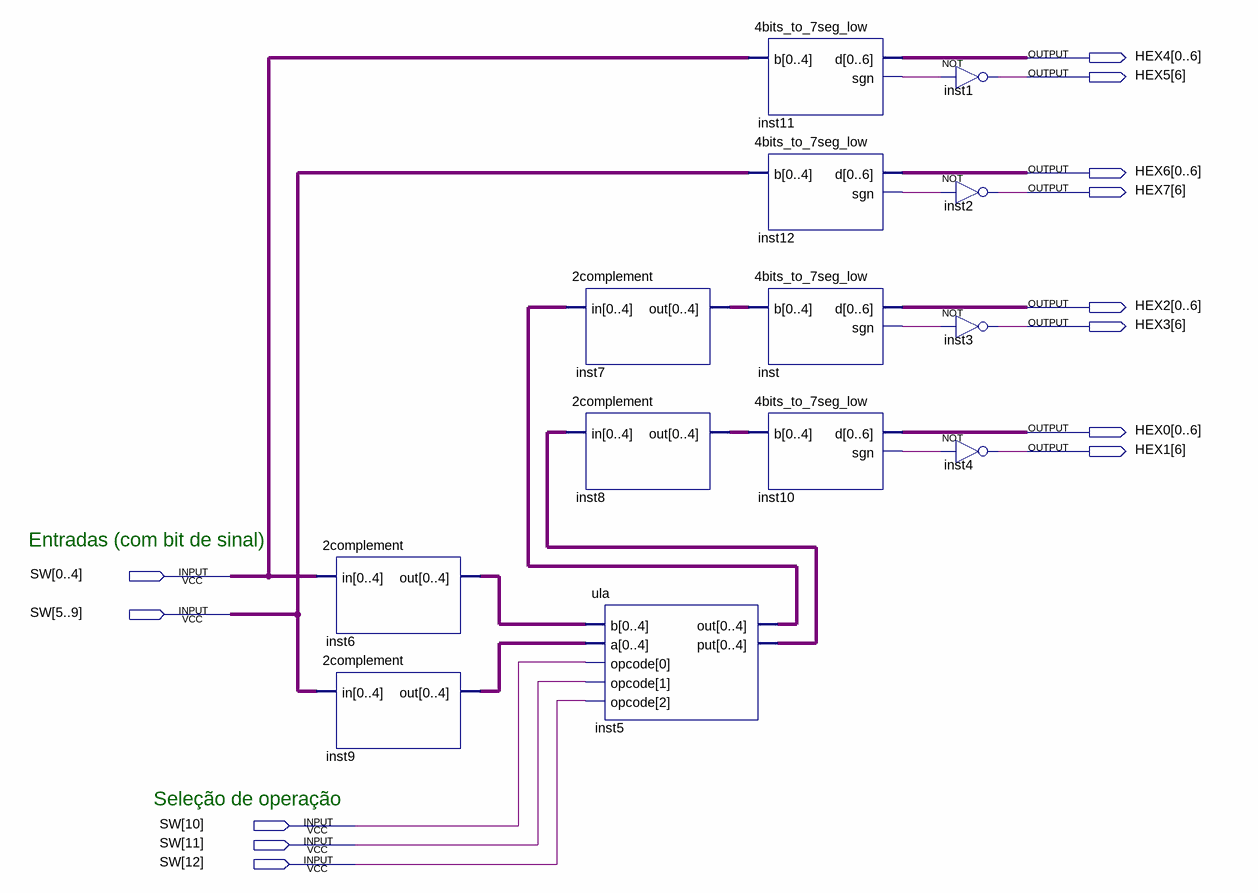
[diagram p0: schematic sheet]
// Quartus schematic proj_final.bdf as structural Verilog: 13 symbols, 13 pins
module proj_final (
  input  [0:12] SW,
  output [0:6] HEX4,
  output [6:6] HEX5,
  output [0:6] HEX6,
  output [6:6] HEX7,
  output [0:6] HEX2,
  output [6:6] HEX3,
  output [0:6] HEX0,
  output [6:6] HEX1
);

  wire inst10_sgn, inst11_sgn, inst12_sgn, inst_sgn;
  wire [4:0] inst5_out, inst5_put, inst6_out, inst7_out, inst8_out, inst9_out;

  \2complement  inst6 (.in(SW[0:4]), .out(inst6_out));
  \2complement  inst9 (.in(SW[5:9]), .out(inst9_out));
  \2complement  inst7 (.in(inst5_out), .out(inst7_out));
  \2complement  inst8 (.in(inst5_put), .out(inst8_out));
  ula inst5 (.b(inst6_out), .a(inst9_out), .opcode({SW[12], SW[11], SW[10]}), .out(inst5_out), .put(inst5_put));
  \4bits_to_7seg_low  inst11 (.b(SW[0:4]), .d(HEX4), .sgn(inst11_sgn));
  \4bits_to_7seg_low  inst12 (.b(SW[5:9]), .d(HEX6), .sgn(inst12_sgn));
  \4bits_to_7seg_low  inst (.b(inst7_out), .d(HEX2), .sgn(inst_sgn));
  \4bits_to_7seg_low  inst10 (.b(inst8_out), .d(HEX0), .sgn(inst10_sgn));
  not inst1 (HEX5[6], inst11_sgn);
  not inst2 (HEX7[6], inst12_sgn);
  not inst3 (HEX3[6], inst_sgn);
  not inst4 (HEX1[6], inst10_sgn);

  // Notes on the sheet:
  //   Entradas (com bit de sinal)
  //   Seleção de operação
endmodule
